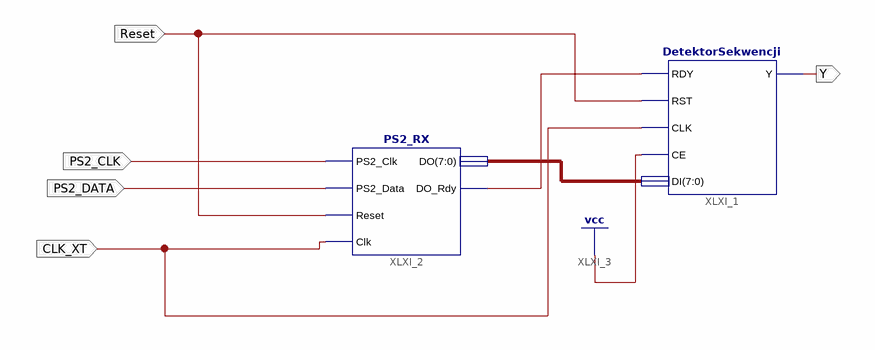
[diagram p0: schematic sheet 1]
// Xilinx ISE schematic DetektorSchemat.sch (spartan6l) as structural Verilog: 2 symbols, 5 ports
module DetektorSchemat (
  input  Reset,
  input  PS2_CLK,
  input  PS2_DATA,
  input  CLK_XT,
  output Y
);

  wire XLXN_10;
  wire [7:0] XLXN_11;

  DetektorSekwencji XLXI_1 (.RDY(XLXN_10), .RST(Reset), .CLK(CLK_XT), .CE(1'b1), .DI(XLXN_11), .Y(Y));
  PS2_RX XLXI_2 (.PS2_Clk(PS2_CLK), .PS2_Data(PS2_DATA), .Clk(CLK_XT), .Reset(Reset), .DO_Rdy(XLXN_10), .DO(XLXN_11));
endmodule
